# EAGLE design MCP23017 (EAGLE 6.3)
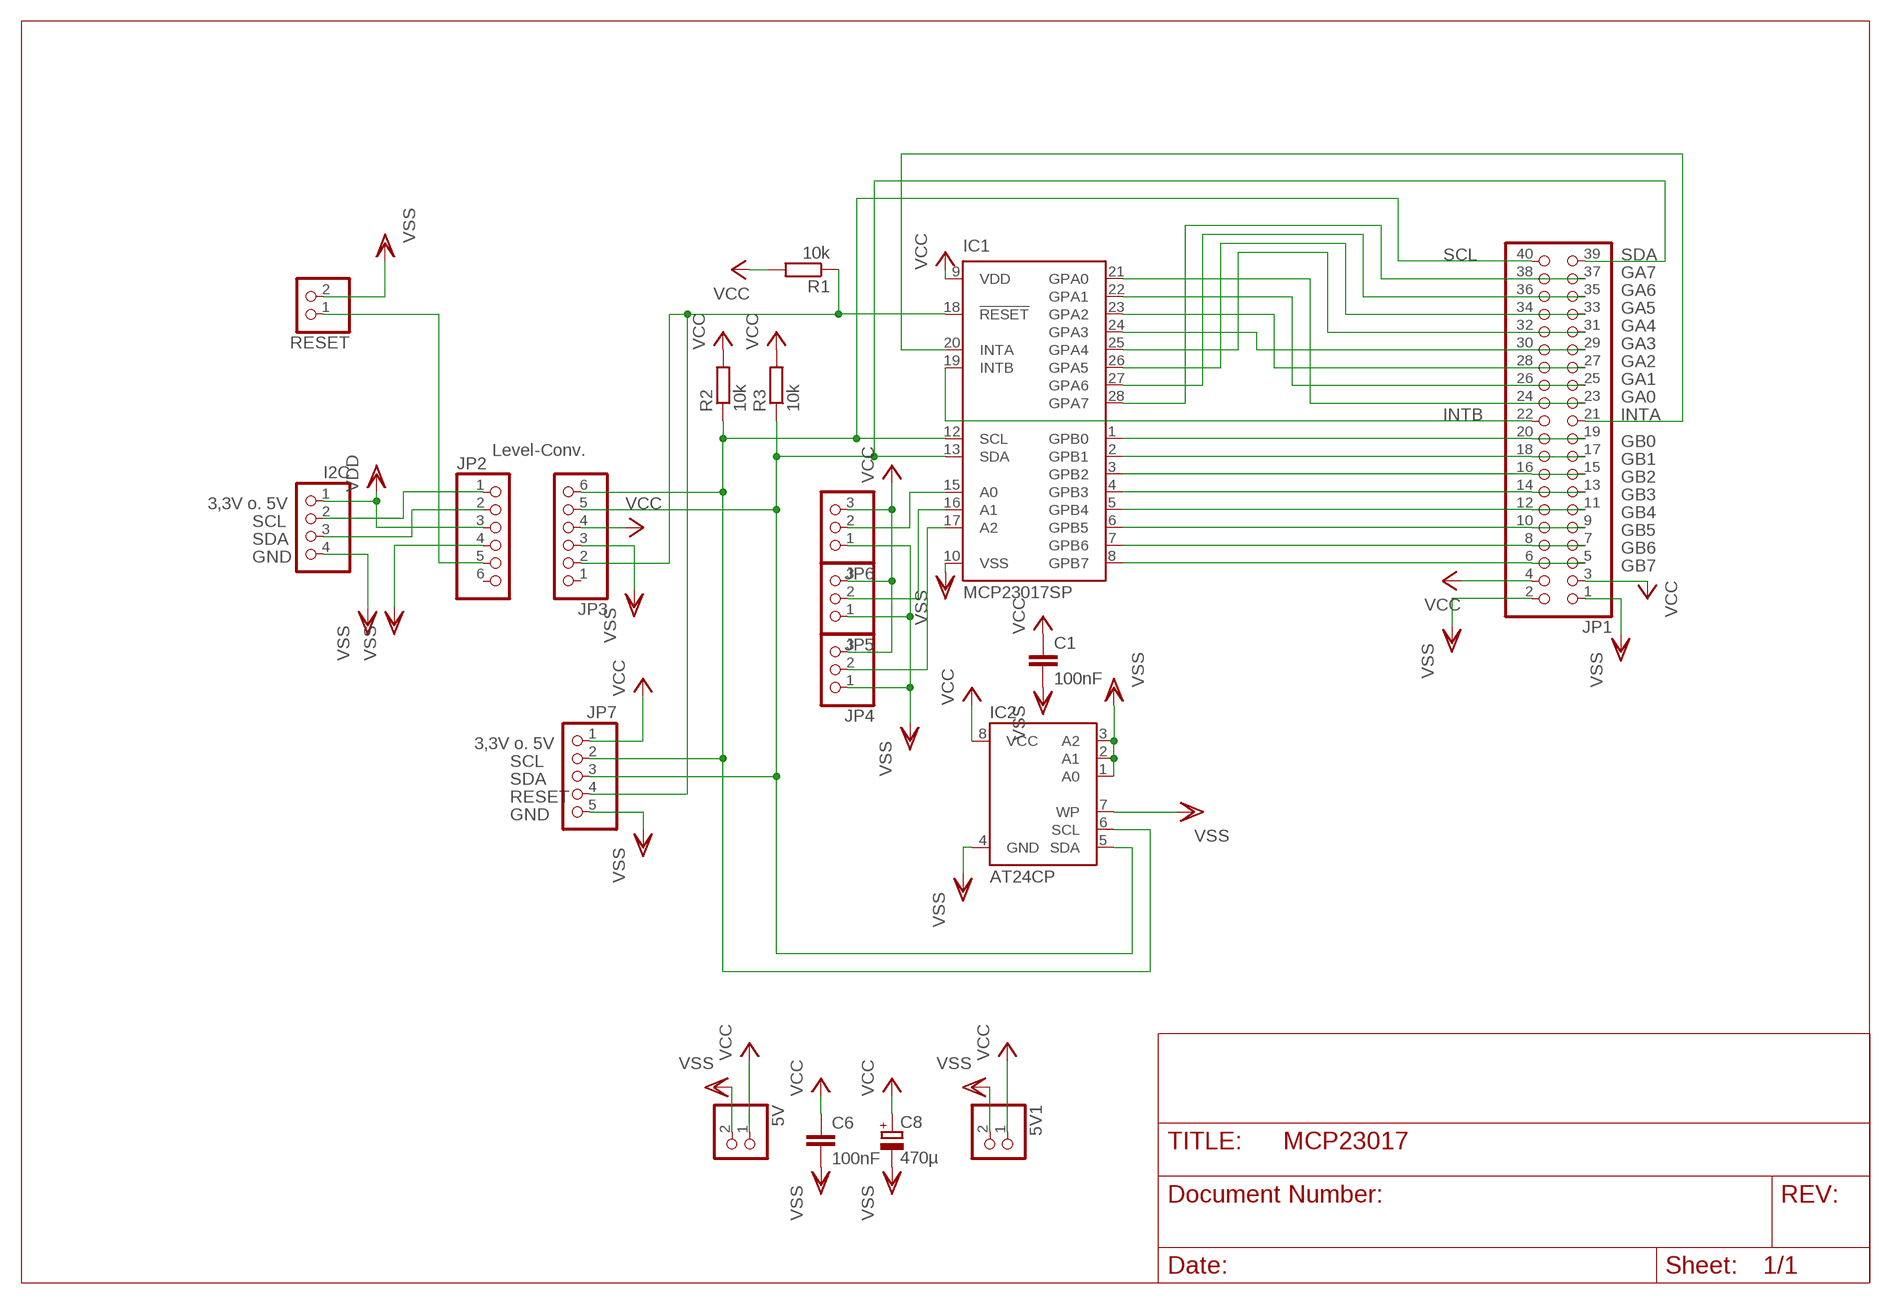
[diagram p0: schematic, sheet 1]

## Parts
5V  PINHD-1X2  [1X02]
5V1  PINHD-1X2  [1X02]
C1  100nF  C-EU025-030X050  [C025-030X050]
C6  100nF  C-EU025-030X050  [C025-030X050]
C8  470µ  CPOL-EUE3.5-10  [E3,5-10]
I2C  PINHD-1X4  [1X04]
IC1  MCP23017SP  [DIL28-3]
IC2  AT24CP  [DIL08]
JP1  PINHD-2X20  [2X20]
JP2  PINHD-1X6  [1X06]
JP3  PINHD-1X6  [1X06]
JP4  PINHD-1X3  [1X03]
JP5  PINHD-1X3  [1X03]
JP6  PINHD-1X3  [1X03]
JP7  PINHD-1X5  [1X05]
R1  10k  R-EU_0207/10  [0207/10]
R2  10k  R-EU_0207/10  [0207/10]
R3  10k  R-EU_0207/10  [0207/10]
RESET  PINHD-1X2  [1X02]

## Nets
A0: IC1.21(GPA0) JP1.23 JP1.24
A1: IC1.22(GPA1) JP1.25 JP1.26
A2: IC1.23(GPA2) JP1.27 JP1.28
A3: IC1.24(GPA3) JP1.29 JP1.30
A4: IC1.25(GPA4) JP1.31 JP1.32
A5: IC1.26(GPA5) JP1.33 JP1.34
A6: IC1.27(GPA6) JP1.35 JP1.36
A7: IC1.28(GPA7) JP1.37 JP1.38
B0: IC1.1(GPB0) JP1.19 JP1.20
B1: IC1.2(GPB1) JP1.17 JP1.18
B2: IC1.3(GPB2) JP1.15 JP1.16
B3: IC1.4(GPB3) JP1.13 JP1.14
B4: IC1.5(GPB4) JP1.11 JP1.12
B5: IC1.6(GPB5) JP1.9 JP1.10
B6: IC1.7(GPB6) JP1.7 JP1.8
B7: IC1.8(GPB7) JP1.5 JP1.6
INTA: IC1.20(INTA) JP1.21
INTB: IC1.19(INTB) JP1.22
N$14: IC1.15(A0) JP6.2
N$21: IC1.16(A1) JP5.2
N$22: IC1.17(A2) JP4.2
RESET: IC1.18(!RESET) JP3.2 JP7.4 R1.1
RESET-IN: JP2.5 RESET.1
SCL: IC1.12(SCL) IC2.6(SCL) JP1.40 JP3.6 JP7.2 R2.1
SCL-IN: I2C.2 JP2.1
SDA: IC1.13(SDA) IC2.5(SDA) JP1.39 JP3.5 JP7.3 R3.1
SDA-IN: I2C.3 JP2.2
VCC [Power]: 5V1.1 5V.1 C1.1 C6.1 C8.+ IC1.9(VDD) IC2.8(VCC) JP1.3 JP1.4 JP3.4 JP4.3 JP5.3 JP6.3 JP7.1 R1.2 R2.2 R3.2
VDD [Power]: I2C.1 JP2.3
VSS [Power]: 5V1.2 5V.2 C1.2 C6.2 C8.- I2C.4 IC1.10(VSS) IC2.1(A0) IC2.2(A1) IC2.3(A2) IC2.4(GND) IC2.7(WP) JP1.1 JP1.2 JP2.4 JP3.3 JP4.1 JP5.1 JP6.1 JP7.5 RESET.2
Unconnected: JP2.6 JP3.1

## Notes on the sheet
- SCL | SDA
- GA7
- GA6
- GA5
- GA4
- GA3
- GA2
- GA1
- GA0
- INTB | INTA
- GB0
- Level-Conv.
- GB1
- GB2
- GB3
- 3,3V o. 5V
- GB4
- SCL
- GB5
- SDA
- GB6
- GND
- GB7
- 3,3V o. 5V
- SCL
- SDA
- RESET
- GND

## Library data of the parts
5V 5V1 RESET = pinhead:PINHD-1X2: PIN HEADER
C1 C6 = rcl:C-EU: CAPACITOR, European symbol
C8 = rcl:CPOL-EU: POLARIZED CAPACITOR, European symbol
I2C = pinhead:PINHD-1X4: PIN HEADER
IC1 = microchip:MCP23017: http://ww1.microchip.com/downloads/en/DeviceDoc/21952a.pdf Source: http://ww1.microchip.com/downloads/en/DeviceDoc/21952a.pdf; MF: MICROCHIP; MPN: MCP23017-E/SP; OC_FARNELL: 1332088; OC_NEWARK: 31K2959
IC2 = atmel:AT24C*: 2-wire serial EEPROM; MPN: AT24C1024BW-SH-B; OC_FARNELL: 1362646; OC_NEWARK: 03P2044
JP1 = pinhead:PINHD-2X20: PIN HEADER
JP2 JP3 = pinhead:PINHD-1X6: PIN HEADER
JP4-JP6 = pinhead:PINHD-1X3: PIN HEADER
JP7 = pinhead:PINHD-1X5: PIN HEADER
R1-R3 = rcl:R-EU_: RESISTOR, European symbol

## Net classes
0 default: width 0.254 mm, clearance 0.254 mm
1 Power: width 0.635 mm, drill 0.61 mm, clearance 0.381 mm
2 VCC: width 0.635 mm, drill 0.61 mm, clearance 0.381 mm

## Board
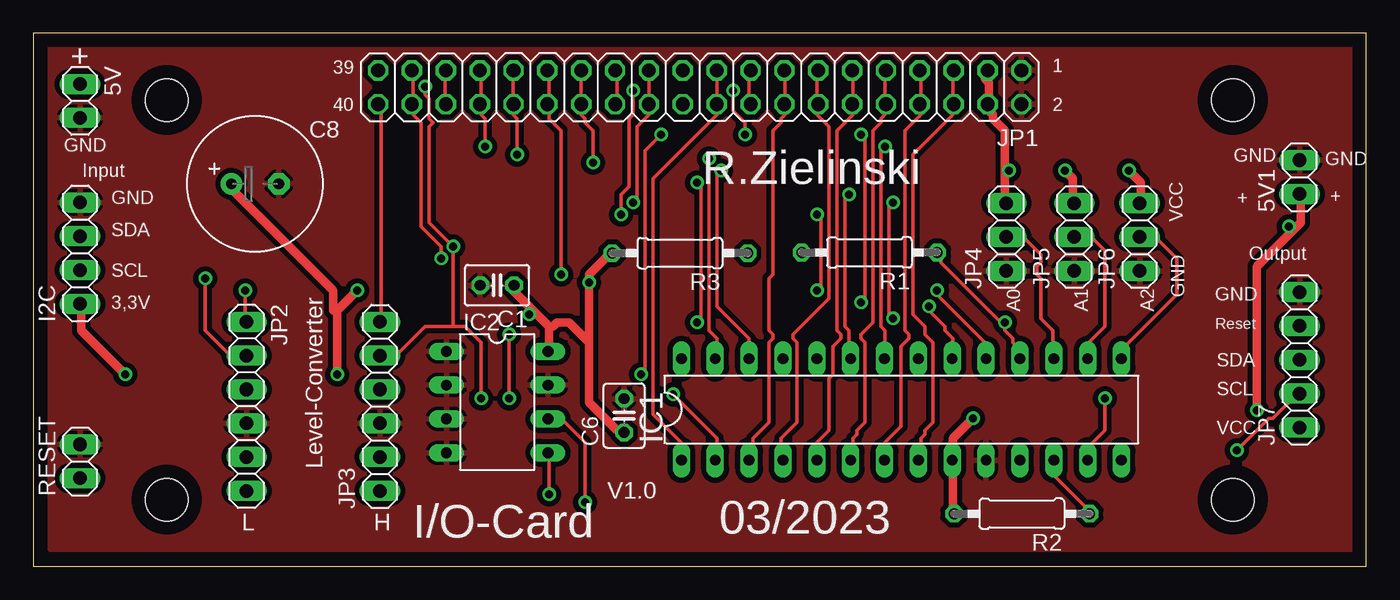
[diagram p1: board, top side]
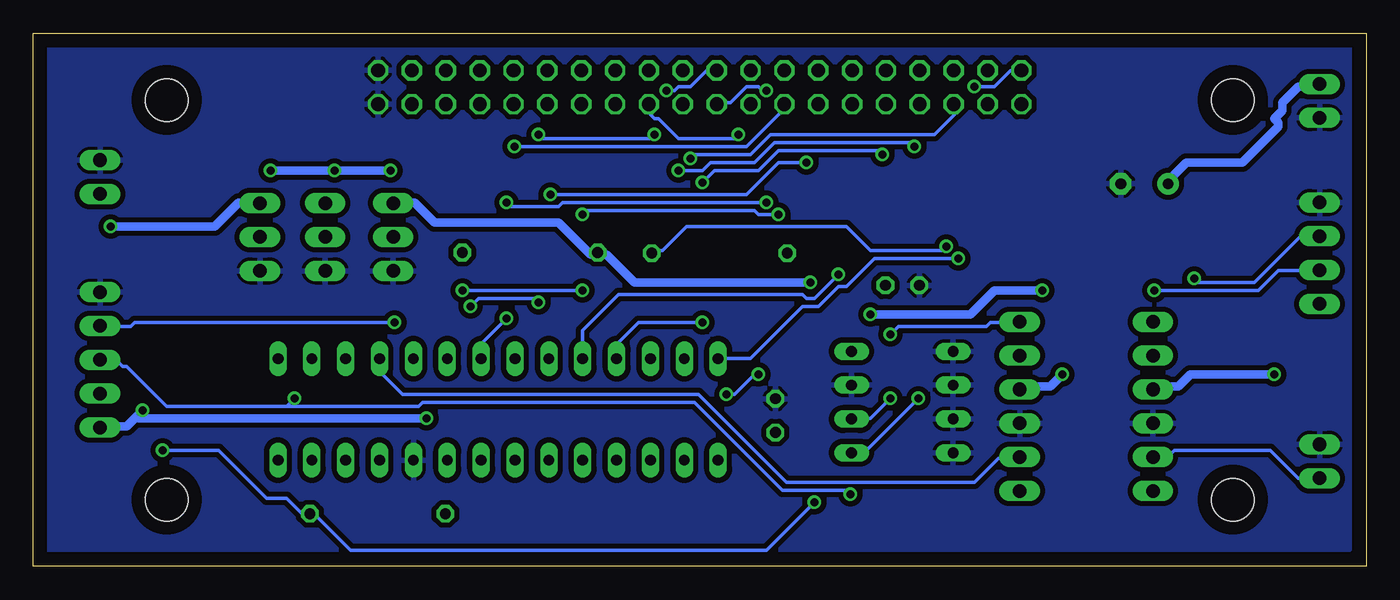
[diagram p2: board, bottom side, seen from below]

Size 100 x 40 mm. Coordinates in mm from the lower left corner, seen from the top.
Outline: 0,0 100,0 100,40 0,40 0,0
Copper layers (1*16): Top 0.035mm / dielectric 1.5mm / Bottom 0.035mm
Design rules "default": minimum track width 10mil, minimum drill 24mil, track to track 8mil, track to pad 8mil, pad to pad 8mil, via to via 8mil, smd to smd 8mil, copper to edge 40mil, drill to drill 8mil, minimum pad ring 10mil, minimum via ring 8mil, stop-mask expansion 4mil, vias tented up to drill 0mil, thermal gap 10mil
Holes 3.2 mm at 90,35 10,35 90,5 10,5

### Footprints (pad centres in the part's own frame; a part is rotated, then mirrored left to right if it is on the bottom)
1X02 = drill 1.016 long: 1 -1.27,0; 2 1.27,0
C025-030X050 = drill 0.813 octagon: 1 -1.27,0; 2 1.27,0
E3,5-10 = drill 0.813 pad 1.6: + -1.778,0 | drill 0.813 pad 1.6 octagon: - 1.778,0
1X04 = drill 1.016 long: 1 -3.81,0; 2 -1.27,0; 3 1.27,0; 4 3.81,0
DIL28-3 = drill 0.813 long: 1 -16.51,-3.81; 2 -13.97,-3.81; 3 -11.43,-3.81; 4 -8.89,-3.81; 5 -6.35,-3.81; 6 -3.81,-3.81; 7 -1.27,-3.81; 8 1.27,-3.81; 9 3.81,-3.81; 10 6.35,-3.81; 11 8.89,-3.81; 12 11.43,-3.81; 13 13.97,-3.81; 14 16.51,-3.81; 15 16.51,3.81; 16 13.97,3.81; 17 11.43,3.81; 18 8.89,3.81; 19 6.35,3.81; 20 3.81,3.81; 21 1.27,3.81; 22 -1.27,3.81; 23 -3.81,3.81; 24 -6.35,3.81; 25 -8.89,3.81; 26 -11.43,3.81; 27 -13.97,3.81; 28 -16.51,3.81
DIL08 = drill 0.813 long: 1 -3.81,-3.81; 2 -1.27,-3.81; 3 1.27,-3.81; 4 3.81,-3.81; 5 3.81,3.81; 6 1.27,3.81; 7 -1.27,3.81; 8 -3.81,3.81
2X20 = drill 1.016 octagon: 1 -24.13,-1.27; 2 -24.13,1.27; 3 -21.59,-1.27; 4 -21.59,1.27; 5 -19.05,-1.27; 6 -19.05,1.27; 7 -16.51,-1.27; 8 -16.51,1.27; 9 -13.97,-1.27; 10 -13.97,1.27; 11 -11.43,-1.27; 12 -11.43,1.27; 13 -8.89,-1.27; 14 -8.89,1.27; 15 -6.35,-1.27; 16 -6.35,1.27; 17 -3.81,-1.27; 18 -3.81,1.27; 19 -1.27,-1.27; 20 -1.27,1.27; 21 1.27,-1.27; 22 1.27,1.27; 23 3.81,-1.27; 24 3.81,1.27; 25 6.35,-1.27; 26 6.35,1.27; 27 8.89,-1.27; 28 8.89,1.27; 29 11.43,-1.27; 30 11.43,1.27; 31 13.97,-1.27; 32 13.97,1.27; 33 16.51,-1.27; 34 16.51,1.27; 35 19.05,-1.27; 36 19.05,1.27; 37 21.59,-1.27; 38 21.59,1.27; 39 24.13,-1.27; 40 24.13,1.27
1X06 = drill 1.016 long: 1 -6.35,0; 2 -3.81,0; 3 -1.27,0; 4 1.27,0; 5 3.81,0; 6 6.35,0
1X03 = drill 1.016 long: 1 -2.54,0; 2 0,0; 3 2.54,0
1X05 = drill 1.016 long: 1 -5.08,0; 2 -2.54,0; 3 0,0; 4 2.54,0; 5 5.08,0
0207/10 = drill 0.813 octagon: 1 -5.08,0; 2 5.08,0

### Placement (x,y rotation side)
5V  3.5,34.92 270 top
5V1  95,29.21 90 top
C1  34.8,21.08 180 top
C6  44.32,11.3 90 top
C8  16.64,28.7 0 top
I2C  3.5,23.5 90 top
IC1  65.13,11.77 0 top
IC2  34.8,12.32 270 top
JP1  50,35.95 180 top
JP2  16,12 270 top
JP3  26,12 90 top
JP4  73,24.71 90 top
JP5  78.1,24.71 90 top
JP6  83,24.71 90 top
JP7  95,15.49 90 top
R1  62.74,23.55 180 top
R2  74.17,3.94 180 top
R3  48.51,23.5 180 top
RESET  3.5,7.87 90 top

### Tracks (layer width: path | path; a pad name or v marks a point on that pad's centre or on a via)
A0  (via drill 0.61)
  Top 0.254: v64.5,18.6 64.2,18.9 64.2,27 v64.5,27.3 | v45,27.3 45.3,27.6 45.3,33 46.2,33.9 46.2,34.5 JP1.24 46.2,34.8 46.2,37.2 JP1.23
  Bottom 0.254: v64.5,18.6 66.3,16.8 66.3,15.6 IC1.21 | v64.5,27.3 64.2,27 60.6,27 60.3,27.3 v45,27.3
A1  (via drill 0.61)
  Top 0.254: v63.9,31.5 63.6,31.2 63.6,18 63.9,17.7 63.9,15.6 IC1.22 | JP1.25 43.8,37.2 43.8,34.8 JP1.26
  Bottom 0.254: v63.9,31.5 46.5,31.5 43.5,34.5 JP1.26
A2  (via drill 0.61)
  Top 0.254: v61.2,27.9 60.9,27.6 60.9,18 61.2,17.7 61.2,15.6 IC1.23 | v42,30.3 42,32.7 41.4,33.3 41.4,33.6 41.1,33.9 41.1,34.5 JP1.28 41.1,34.8 41.1,37.2 JP1.27
  Bottom 0.254: v61.2,27.9 46.5,27.9 44.1,30.3 v42,30.3
A3  (via drill 0.61)
  Top 0.254: v39.6,21.9 39.6,32.7 38.7,33.6 38.7,34.5 JP1.30 38.7,34.8 38.7,37.2 JP1.29
  Bottom 0.254: v39.6,21.9 41.4,20.1 42,20.1 42.3,20.4 56.1,20.4 58.8,17.7 58.8,15.6 IC1.24
A4  (via drill 0.61)
  Top 0.254: v49.8,18.3 50.1,18.6 50.1,28.5 v49.8,28.8 | v36.3,30.9 36.3,33.6 36,33.9 36,34.5 JP1.32 36,34.8 36,37.2 JP1.31
  Bottom 0.254: v49.8,18.3 54.6,18.3 56.1,16.8 56.1,15.6 IC1.25 | v49.8,28.8 48.9,29.7 45.6,29.7 44.1,31.2 36.6,31.2 v36.3,30.9
A5  (via drill 0.61)
  Top 0.254: v51.6,29.7 51.3,29.4 51.3,19.5 53.7,17.1 53.7,15.6 IC1.26 | v33.9,31.5 33.9,33.6 33.6,33.9 33.6,34.5 JP1.34 33.6,34.8 33.6,37.2 JP1.33
  Bottom 0.254: v51.6,29.7 49.8,29.7 49.2,30.3 45.9,30.3 44.4,31.8 34.2,31.8 v33.9,31.5
A6  (via drill 0.61)
  Top 0.254: v50.7,30.6 50.7,17.7 51.3,17.1 51.3,15.6 IC1.27 | JP1.35 30.9,37.2 30.9,34.8 JP1.36
  Bottom 0.254: v50.7,30.6 50.4,30.9 46.2,30.9 44.7,32.4 32.4,32.4 30.9,33.9 30.9,34.5 JP1.36
A7  (via drill 0.61)
  Top 0.254: v30.6,23.1 30.6,24 29.1,25.5 29.1,33.3 28.5,33.9 28.5,34.5 JP1.38 28.5,34.8 28.5,37.2 JP1.37
  Bottom 0.254: v30.6,23.1 36.9,23.1 39,21 39.6,21 41.1,19.5 42.3,19.5 46.2,15.6 48.6,15.6 IC1.28
B0
  Top 0.254: IC1.1 48.6,8.1 48.6,9.3 46.5,11.4 46.5,29.1 51.3,33.9 51.3,34.5 JP1.20 51.3,34.8 51.3,37.2 JP1.19
B1  (via drill 0.61)
  Top 0.254: v48,12.9 51.3,9.6 51.3,8.1 IC1.2 | v45.6,14.4 45.9,14.7 45.9,31.2 v47.1,32.4 | JP1.17 53.7,37.2 53.7,34.8 JP1.18
  Bottom 0.254: v48,12.9 47.4,12.9 45.9,14.4 v45.6,14.4 | v47.1,32.4 47.4,32.1 51.6,32.1 53.1,33.6 53.4,33.6 53.7,33.9 53.7,34.5 JP1.18
B2
  Top 0.254: IC1.3 54,8.1 54,9.6 55.2,10.8 55.2,16.8 55.5,17.1 55.5,17.4 55.2,17.7 55.2,21.6 55.5,21.9 55.5,32.7 56.1,33.3 56.1,33.6 56.4,33.9 56.4,34.5 JP1.16 56.4,34.8 56.4,37.2 JP1.15
B3
  Top 0.254: IC1.4 56.1,8.1 56.1,9.6 57.3,10.8 57.3,16.8 57,17.1 57,17.4 59.7,20.1 59.7,33 58.8,33.9 58.8,34.5 JP1.14 58.8,34.8 58.8,37.2 JP1.13
B4
  Top 0.254: IC1.5 58.8,8.1 58.8,9.3 59.7,10.2 59.7,14.1 60,14.4 60,16.5 60.6,17.1 60.6,17.4 60.3,17.7 60.3,32.7 61.5,33.9 61.5,34.5 JP1.12 61.5,34.8 61.5,37.2 JP1.11
B5
  Top 0.254: IC1.6 61.5,8.1 61.5,9.6 61.8,9.9 61.8,10.2 62.4,10.8 62.4,16.8 62.1,17.1 62.1,17.4 63,18.3 63,32.7 63.6,33.3 63.6,33.6 63.9,33.9 63.9,34.5 JP1.10 63.9,34.8 63.9,37.2 JP1.9
B6
  Top 0.254: IC1.7 63.9,8.1 63.9,9.3 65.1,10.5 65.1,16.5 65.7,17.1 65.7,17.4 65.4,17.7 65.4,32.7 66.6,33.9 66.6,34.5 JP1.8 66.6,34.8 66.6,37.2 JP1.7
B7
  Top 0.254: IC1.8 66.6,8.1 66.6,9.6 66.9,9.9 66.9,10.2 67.5,10.8 67.5,16.8 66.9,17.4 66.9,18 66,18.9 66,30.9 69,33.9 69,34.5 JP1.6 69,34.8 69,37.2 JP1.5
INTA  (via drill 0.61)
  Top 0.254: v67.2,19.5 67.2,19.2 68.4,18 68.4,17.7 69,17.1 69,15.6 IC1.20 | v62.1,19.8 62.4,20.1 62.4,32.1 v62.1,32.4 | v53.4,32.4 53.4,33.3 52.5,34.2 v52.5,35.7
  Bottom 0.254: v67.2,19.5 66.6,20.1 62.4,20.1 v62.1,19.8 | v62.1,32.4 61.8,32.1 53.7,32.1 v53.4,32.4 | v52.5,35.7 51.9,35.7 51.6,36 50.7,36 49.5,37.2 48.9,37.2 JP1.21
INTB  (via drill 0.61)
  Top 0.254: v67.8,20.7 67.8,20.4 71.4,16.8 71.4,15.6 IC1.19 | v58.8,20.7 59.1,21 59.1,26.1 v58.8,26.4 | v44.1,26.4 44.1,27.9 44.7,28.5 44.7,33.6 45,33.9 v45,35.7
  Bottom 0.254: v58.8,20.7 v67.8,20.7 | v58.8,26.4 58.5,26.7 45.9,26.7 45.6,26.4 v44.1,26.4 | v45,35.7 45.3,35.7 45.6,36 46.5,36 47.7,34.8 48.6,34.8 JP1.22
N$14
  Top 0.254: IC1.15 81.9,15.6 81.9,16.5 85.8,20.4 85.8,23.1 83.7,25.2 83.1,25.2 83.1,24.9 JP6.2
N$21
  Top 0.254: IC1.16 79.2,15.6 79.2,16.8 80.4,18 80.4,23.7 79.5,24.6 78.3,24.6 JP5.2
N$22
  Top 0.254: IC1.17 76.5,15.6 76.5,17.7 75.6,18.6 75.6,21.6 75.3,21.9 75.3,22.5 75.6,22.8 75.6,23.4 74.4,24.6 73.2,24.6 JP4.2
RESET  (via drill 0.61)
  Top 0.254: 72.9,18 68.1,22.8 68.1,23.4 R1.1 | 72.9,18 72.9,17.7 73.5,17.1 73.5,16.8 74.1,16.2 74.1,15.6 IC1.18 | 72.9,18 v72.9,18.3
  Bottom 0.254: JP3.2 26.1,8.1 27.6,8.1 29.4,6.3 43.5,6.3 50.1,12.9 72.3,12.9 73.8,14.4 73.8,15.3 IC1.18 | v72.9,18.3 92.4,18.3 92.7,18 94.8,18 JP7.4
RESET-IN
  Bottom 0.254: RESET.1 3.6,6.6 5.1,6.6 7.2,8.7 14.4,8.7 15,8.1 15.9,8.1 JP2.5
SCL  (via drill 0.61)
  Top 0.254: R2.1 79.2,4.2 76.5,6.9 76.5,7.8 IC1.12 | v90.3,8.7 92.7,11.1 93,11.1 94.8,12.9 JP7.2 | v35.7,17.4 v35.7,12.6 | JP1.40 26.1,34.5 26.1,18.6 JP3.6 | v41.4,4.8 41.4,9.3 39.3,11.4 38.7,11.4 38.7,11.1 IC2.6
  Bottom 0.254: v90.3,8.7 86.1,8.7 82.5,5.1 81,5.1 79.8,3.9 79.5,3.9 R2.1 79.2,3.9 78.9,3.9 76.2,1.2 45,1.2 v41.4,4.8 | v35.7,12.6 37.2,11.1 38.4,11.1 IC2.6 | v35.7,17.4 35.1,18 28.5,18 28.2,18.3 26.1,18.3 JP3.6
SCL-IN  (via drill 0.61)
  Top 0.254: v15.9,20.7 15.9,18.6 JP2.1
  Bottom 0.254: v15.9,20.7 8.1,20.7 6.6,22.2 3.6,22.2 I2C.2
SDA  (via drill 0.61)
  Top 0.254: v80.4,12.6 80.4,10.2 79.2,9 79.2,8.1 IC1.13 | v33.6,12.6 33.6,16.8 32.4,18 31.5,18 | 31.5,18 29.4,18 26.7,15.3 26.1,15.3 26.1,15.6 JP3.5 | 31.5,18 v31.5,24 29.7,25.8 29.7,33 30,33.3 29.7,33.6 29.7,35.1 29.4,35.4 v29.4,36 | v38.7,5.4 38.7,8.4 IC2.5
  Bottom 0.254: 81,12 v80.4,12.6 | 81,12 90,12 93,15 93.3,15 93.9,15.6 94.8,15.6 JP7.3 | v33.6,12.6 37.5,8.7 38.4,8.7 IC2.5 | v31.5,24 31.8,23.7 37.2,23.7 39,25.5 51,25.5 52.8,23.7 53.4,23.7 R3.1 | v29.4,36 27.9,36 26.7,37.2 26.1,37.2 JP1.39 | 81,12 71.1,12 70.8,12.3 50.4,12.3 43.8,5.7 39,5.7 v38.7,5.4
SDA-IN  (via drill 0.61)
  Top 0.254: v12.9,21.6 12.9,17.7 15.3,15.3 15.9,15.3 15.9,15.6 JP2.2
  Bottom 0.254: v12.9,21.6 12.6,21.3 8.4,21.3 4.8,24.9 3.6,24.9 I2C.3
VCC  (via drill 0.61)
  Top 0.635: JP1.3 71.7,37.2 71.7,36.9 71.4,36.6 71.7,36.3 71.7,34.8 JP1.4 71.7,34.5 71.7,34.2 72,33.9 72,33.6 72.9,32.7 72.9,29.7 | 72.9,29.7 72.9,27.3 JP4.3 | v77.4,29.7 78,29.1 78,27.3 JP5.3 | v73.2,29.7 72.9,29.7 | v82.2,29.7 83.1,28.8 83.1,27.3 JP6.3 | 69,8.1 IC1.9 | IC1.9 69,7.8 69,4.2 R2.2 | v91.8,11.7 91.8,22.5 94.35,25.05 | 94.35,25.05 95.1,25.8 95.1,27.9 5V1.1 | v70.5,11.1 69,9.6 69,8.4 IC1.9 | v94.2,25.5 94.2,25.2 94.35,25.05 | 38.7,16.2 IC2.8 38.7,16.5 38.7,18 | 37.35,19.35 36,20.7 36,21 C1.1 | 37.35,19.35 38.7,18 | 41.7,16.8 41.7,12.3 43.8,10.2 44.1,10.2 C6.1 | 41.7,16.8 40.2,18.3 39.3,18.3 39,18 38.7,18 | 41.7,16.8 v41.7,21.3 41.7,21.9 43.2,23.4 R3.2 | 22.8,19.2 v22.8,14.4 | v24.3,20.7 22.8,19.2 | v37.2,18.9 37.2,19.2 37.35,19.35 | C8.+ 15,28.5 15,28.2 22.5,20.7 22.5,19.2 22.8,19.2
  Bottom 0.635: v73.2,29.7 v77.4,29.7 v82.2,29.7 | v91.8,11.7 92.25,11.25 | 92.25,11.25 93,10.5 94.8,10.5 JP7.1 | v70.5,11.1 92.1,11.1 92.25,11.25 | v94.2,25.5 86.4,25.5 84.6,27.3 83.1,27.3 JP6.3 | 5V.1 3.6,36 5.1,36 6.3,34.8 6.3,34.2 6.9,33.6 6.6,33.3 6.6,33 9.3,30.3 13.5,30.3 15,28.8 C8.+ | v41.7,21.3 54.9,21.3 57,23.4 57.6,23.4 R1.2 57.9,23.4 58.2,23.4 60.6,25.8 69.9,25.8 71.4,27.3 72.9,27.3 JP4.3 | v22.8,14.4 23.7,13.5 25.8,13.5 JP3.4 | v24.3,20.7 27.9,20.7 29.7,18.9 v37.2,18.9
VDD  (via drill 0.61)
  Top 0.635: v6.9,14.4 3.6,17.7 3.6,19.5 I2C.1
  Bottom 0.635: v6.9,14.4 13.2,14.4 14.1,13.5 14.7,13.5 15,13.2 15.9,13.2 JP2.3
VSS
  pour Top: 1.27,39 99,39 99,1.27 1.27,1.27
  pour Bottom: 1.27,39 99,39 99,1.27 1.27,1.27

### Text on the board
tPlace: A0 | A1 | A2
tNames: + | 39 | 1 | 40 | 2 | GND | GND | GND | Input | R.Zielinski | VCC | GND | + | + | SDA | GND | Output | SCL | Level-Converter | GND | 3,3V | Reset | SDA | SCL | VCC | V1.0 | L | H | I/O-Card | 03/2023